# EAGLE board paris_wheel (EAGLE 7.3.0)
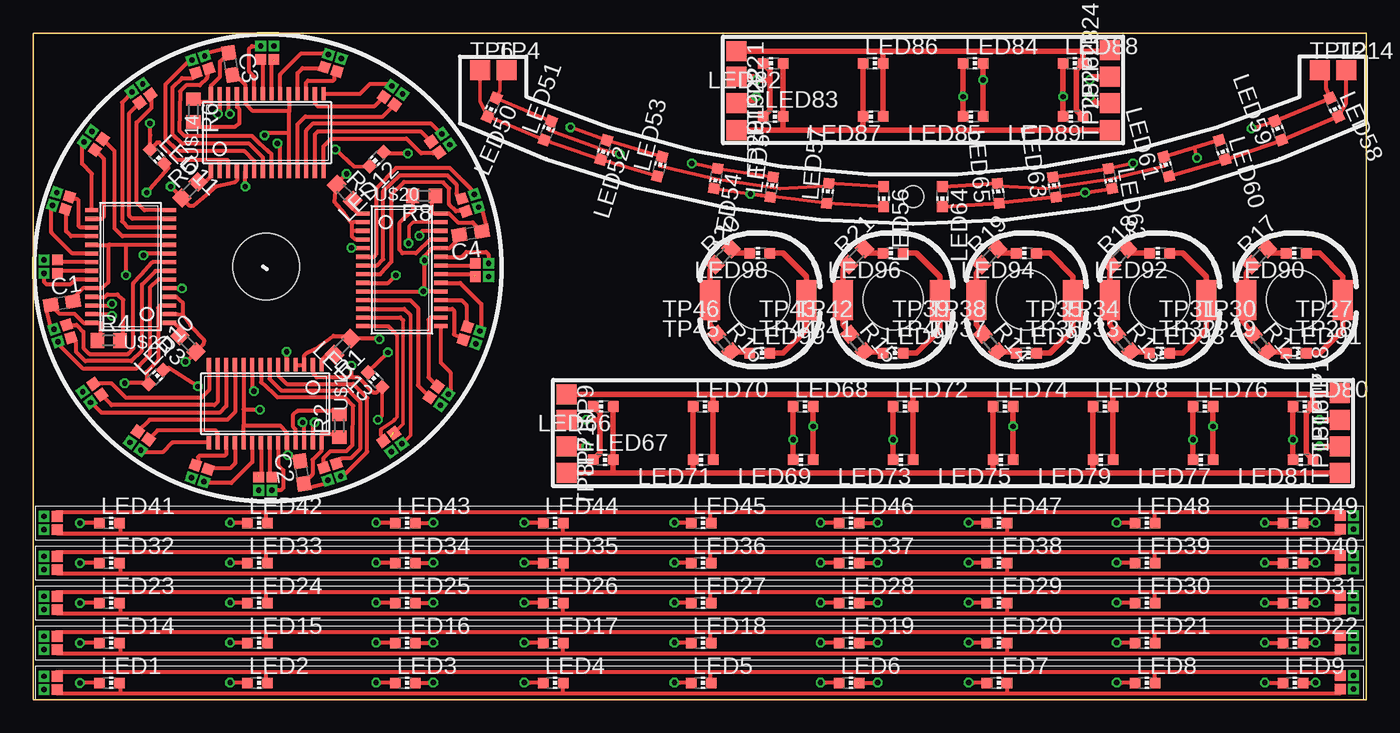
[diagram p1: board, top side]
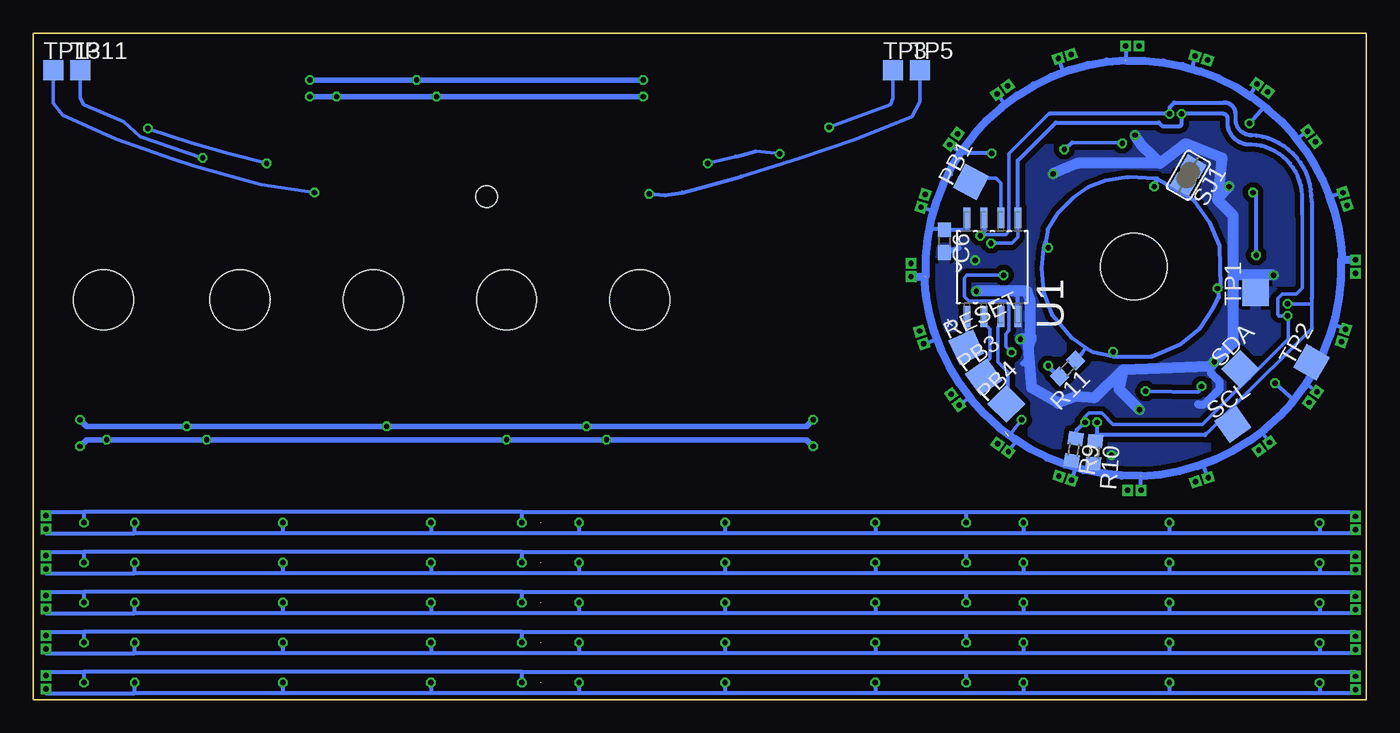
[diagram p2: board, bottom side, seen from below]

Size 100 x 50 mm. Coordinates in mm from the lower left corner, seen from the top.
Outline: 100,0 100,50 0,50 0,0 100,0
Copper layers (1*16): Top 0.035mm / dielectric 1.5mm / Bottom 0.035mm
Design rules "Elecrow_2-layer_eagle_rule *": minimum track width 6mil, minimum drill 12mil, track to track 6mil, track to pad 6mil, pad to pad 6mil, via to via 6mil, smd to smd 0mil, copper to edge 10mil, drill to drill 10mil, minimum pad ring 6mil, minimum via ring 6mil, stop-mask expansion 2mil, vias tented up to drill 100mil, thermal gap 10mil
Holes 5 mm at 17.45,32.5
Holes 1.6 mm at 66,37.75
Holes 4.5 mm at 94.75,30 84.5,30 74.5,30 64.5,30 54.5,30
bRestrict: area 11.6,26.2 to 23.7,38.4

## Footprints (pad centres in the part's own frame; a part is rotated, then mirrored left to right if it is on the bottom)
C0603 = smd 1.1 x 1: 1 -0.85,0; 2 0.85,0
CHIP-LED0603 = smd 0.8 x 0.8: A 0,-0.75; C 0,0.75
TP20SQ = smd 2 x 2: TP 0,0
R0603 = smd 1 x 1.1: 1 -0.85,0; 2 0.85,0
SJ = smd 1.168 x 1.6: 1 -0.762,0; 2 0.762,0
TP15SQ = smd 1.5 x 1.5: TP 0,0
SOIC127P798X216-8N = smd 1.549 x 0.533: 1 -3.708,1.905; 2 -3.708,0.635; 3 -3.708,-0.635; 4 -3.708,-1.905; 5 3.708,-1.905; 6 3.708,-0.635; 7 3.708,0.635; 8 3.708,1.905
TSSOP28 = smd 0.305 x 0.991: 1 -4.225,-2.918; 2 -3.575,-2.918; 3 -2.925,-2.918; 4 -2.275,-2.918; 5 -1.625,-2.918; 6 -0.975,-2.918; 7 -0.325,-2.918; 8 0.325,-2.918; 9 0.975,-2.918; 10 1.625,-2.918; 11 2.275,-2.918; 12 2.925,-2.918; 13 3.575,-2.918; 14 4.225,-2.918; 15 4.225,2.918; 16 3.575,2.918; 17 2.925,2.918; 18 2.275,2.918; 19 1.625,2.918; 20 0.975,2.918; 21 0.325,2.918; 22 -0.325,2.918; 23 -0.975,2.918; 24 -1.625,2.918; 25 -2.275,2.918; 26 -2.925,2.918; 27 -3.575,2.918; 28 -4.225,2.918
MINI-PCB-CONNECTOR = drill 0.4 pad 0.8 square: A 0,0; B 0,-1 | smd 0.8 x 0.8: C 1,-1; V+ 1,0

## Placement (x,y rotation side)
C1  100n  [C0603]  2.15,29.75 9 top
C2  100n  [C0603]  20.15,17.05 99 top
C3  100n  [C0603]  14.8,47.7 279 top
C4  100n  [C0603]  32.8,35 189 top
C6  NO MOUNT  [C0603]  31.65,34.4 270 bottom
LED1  RED  [CHIP-LED0603]  5.7,1.25 270 top
LED2  BLUE  [CHIP-LED0603]  16.8,1.25 270 top
LED3  YELLOW  [CHIP-LED0603]  27.9,1.25 270 top
LED4  RED  [CHIP-LED0603]  39,1.25 270 top
LED5  BLUE  [CHIP-LED0603]  50.1,1.25 270 top
LED6  YELLOW  [CHIP-LED0603]  61.2,1.25 270 top
LED7  RED  [CHIP-LED0603]  72.3,1.25 270 top
LED8  BLUE  [CHIP-LED0603]  83.4,1.25 270 top
LED9  YELLOW  [CHIP-LED0603]  94.5,1.25 270 top
LED10  BLUE  [CHIP-LED0603]  9.2,24.2 315 top
LED11  BLUE  [CHIP-LED0603]  9.3,40.75 225 top
LED12  BLUE  [CHIP-LED0603]  25.75,40.55 135 top
LED13  BLUE  [CHIP-LED0603]  25.65,24 45 top
LED14  RED  [CHIP-LED0603]  5.7,4.25 270 top
LED15  BLUE  [CHIP-LED0603]  16.8,4.25 270 top
LED16  YELLOW  [CHIP-LED0603]  27.9,4.25 270 top
LED17  RED  [CHIP-LED0603]  39,4.25 270 top
LED18  BLUE  [CHIP-LED0603]  50.1,4.25 270 top
LED19  YELLOW  [CHIP-LED0603]  61.2,4.25 270 top
LED20  RED  [CHIP-LED0603]  72.3,4.25 270 top
LED21  BLUE  [CHIP-LED0603]  83.4,4.25 270 top
LED22  YELLOW  [CHIP-LED0603]  94.5,4.25 270 top
LED23  RED  [CHIP-LED0603]  5.7,7.25 270 top
LED24  BLUE  [CHIP-LED0603]  16.8,7.25 270 top
LED25  YELLOW  [CHIP-LED0603]  27.9,7.25 270 top
LED26  RED  [CHIP-LED0603]  39,7.25 270 top
LED27  BLUE  [CHIP-LED0603]  50.1,7.25 270 top
LED28  YELLOW  [CHIP-LED0603]  61.2,7.25 270 top
LED29  RED  [CHIP-LED0603]  72.3,7.25 270 top
LED30  BLUE  [CHIP-LED0603]  83.4,7.25 270 top
LED31  YELLOW  [CHIP-LED0603]  94.5,7.25 270 top
LED32  RED  [CHIP-LED0603]  5.7,10.25 270 top
LED33  BLUE  [CHIP-LED0603]  16.8,10.25 270 top
LED34  YELLOW  [CHIP-LED0603]  27.9,10.25 270 top
LED35  RED  [CHIP-LED0603]  39,10.25 270 top
LED36  BLUE  [CHIP-LED0603]  50.1,10.25 270 top
LED37  YELLOW  [CHIP-LED0603]  61.2,10.25 270 top
LED38  RED  [CHIP-LED0603]  72.3,10.25 270 top
LED39  BLUE  [CHIP-LED0603]  83.4,10.25 270 top
LED40  YELLOW  [CHIP-LED0603]  94.5,10.25 270 top
LED41  RED  [CHIP-LED0603]  5.7,13.25 270 top
LED42  BLUE  [CHIP-LED0603]  16.8,13.25 270 top
LED43  YELLOW  [CHIP-LED0603]  27.9,13.25 270 top
LED44  RED  [CHIP-LED0603]  39,13.25 270 top
LED45  BLUE  [CHIP-LED0603]  50.1,13.25 270 top
LED46  YELLOW  [CHIP-LED0603]  61.2,13.25 270 top
LED47  RED  [CHIP-LED0603]  72.3,13.25 270 top
LED48  BLUE  [CHIP-LED0603]  83.4,13.25 270 top
LED49  YELLOW  [CHIP-LED0603]  94.5,13.25 270 top
LED50  NO MOUNT (RED)  [CHIP-LED0603]  34.4,44.45 156 top
LED51  NO MOUNT (BLUE)  [CHIP-LED0603]  38.6,42.7 340 top
LED52  NO MOUNT (YELLOW)  [CHIP-LED0603]  42.8,41.25 163 top
LED53  NO MOUNT (RED)  [CHIP-LED0603]  47,40 346 top
LED54  NO MOUNT (BLUE)  [CHIP-LED0603]  51.2,39.1 170 top
LED55  NO MOUNT (RED)  [CHIP-LED0603]  55.4,38.45 352 top
LED56  NO MOUNT (BLUE)  [CHIP-LED0603]  63.8,37.75 180 top
LED57  NO MOUNT (YELLOW)  [CHIP-LED0603]  59.6,38 355 top
LED58  NO MOUNT (RED)  [CHIP-LED0603]  97.6,44.45 204 top
LED59  NO MOUNT (BLUE)  [CHIP-LED0603]  93.4,42.7 20 top
LED60  NO MOUNT (YELLOW)  [CHIP-LED0603]  89.2,41.25 197 top
LED61  NO MOUNT (RED)  [CHIP-LED0603]  85,40 15 top
LED62  NO MOUNT (BLUE)  [CHIP-LED0603]  80.8,39.1 190 top
LED63  NO MOUNT (RED)  [CHIP-LED0603]  76.6,38.45 8 top
LED64  NO MOUNT (BLUE)  [CHIP-LED0603]  68.2,37.75 180 top
LED65  NO MOUNT (YELLOW)  [CHIP-LED0603]  72.4,38 5 top
LED66  YELLOW  [CHIP-LED0603]  42.75,22 90 top
LED67  RED  [CHIP-LED0603]  42.75,18 270 top
LED68  BLUE  [CHIP-LED0603]  57.75,22 270 top
LED69  YELLOW  [CHIP-LED0603]  57.75,18 90 top
LED70  RED  [CHIP-LED0603]  50.25,22 270 top
LED71  BLUE  [CHIP-LED0603]  50.25,18 90 top
LED72  YELLOW  [CHIP-LED0603]  65.25,22 270 top
LED73  RED  [CHIP-LED0603]  65.25,18 90 top
LED74  RED  [CHIP-LED0603]  72.75,22 270 top
LED75  BLUE  [CHIP-LED0603]  72.75,18 90 top
LED76  YELLOW  [CHIP-LED0603]  87.75,22 270 top
LED77  RED  [CHIP-LED0603]  87.75,18 90 top
LED78  BLUE  [CHIP-LED0603]  80.25,22 270 top
LED79  YELLOW  [CHIP-LED0603]  80.25,18 90 top
LED80  RED  [CHIP-LED0603]  95.25,22 270 top
LED81  BLUE  [CHIP-LED0603]  95.25,18 90 top
LED82  BLUE  [CHIP-LED0603]  55.5,47.75 90 top
LED83  YELLOW  [CHIP-LED0603]  55.5,43.75 270 top
LED84  RED  [CHIP-LED0603]  70.5,47.75 270 top
LED85  BLUE  [CHIP-LED0603]  70.5,43.75 90 top
LED86  YELLOW  [CHIP-LED0603]  63,47.75 270 top
LED87  RED  [CHIP-LED0603]  63,43.75 90 top
LED88  BLUE  [CHIP-LED0603]  78,47.75 270 top
LED89  YELLOW  [CHIP-LED0603]  78,43.75 90 top
LED90  YELLOW  [CHIP-LED0603]  94.75,33.5 90 top
LED91  BLUE  [CHIP-LED0603]  94.75,26 270 top
LED92  YELLOW  [CHIP-LED0603]  84.5,33.5 90 top
LED93  BLUE  [CHIP-LED0603]  84.5,26 270 top
LED94  YELLOW  [CHIP-LED0603]  74.5,33.5 90 top
LED95  BLUE  [CHIP-LED0603]  74.5,26 270 top
LED96  YELLOW  [CHIP-LED0603]  64.5,33.5 90 top
LED97  BLUE  [CHIP-LED0603]  64.5,26 270 top
LED98  YELLOW  [CHIP-LED0603]  54.5,33.5 90 top
LED99  BLUE  [CHIP-LED0603]  54.5,26 270 top
PB1  TESTPAD  [TP20SQ]  29.65,38.85 62 bottom
PB3  TESTPAD  [TP20SQ]  28.7,24.2 35 bottom
PB4  TESTPAD  [TP20SQ]  27,22.2 45 bottom
R1  NO MOUNT  [R0603]  23.2,26.5 225 top
R2  10k  [R0603]  22.95,20.55 90 top
R3  NO MOUNT  [R0603]  11.6,26.7 135 top
R4  10k  [R0603]  5.65,26.95 0 top
R5  NO MOUNT  [R0603]  11.75,38.25 45 top
R6  10K  [R0603]  12,44.2 270 top
R7  NO MOUNT  [R0603]  23.35,38.05 315 top
R8  10K  [R0603]  29.3,37.8 180 top
R9  NO MOUNT  [R0603]  21.95,18.75 260 bottom
R10  NO MOUNT  [R0603]  20.4,18.55 265 bottom
R11  NO MOUNT  [R0603]  22.4,24.85 225 bottom
R12  220R  [R0603]  92.05,26.75 310 top
R13  220R  [R0603]  81.8,26.75 310 top
R14  220R  [R0603]  71.8,26.75 310 top
R15  220R  [R0603]  61.8,26.75 310 top
R16  220R  [R0603]  51.8,26.75 310 top
R17  330R  [R0603]  92,33.25 45 top
R18  330R  [R0603]  81.5,33.25 45 top
R19  330R  [R0603]  71.75,33.25 45 top
R20  330R  [R0603]  51.75,33.25 45 top
R21  330R  [R0603]  61.75,33.25 45 top
RESET  TESTPAD  [TP20SQ]  30,26.45 25 bottom
SCL  TESTPAD  [TP20SQ]  10,20.65 35 bottom
SDA  TESTPAD  [TP20SQ]  9.45,24.8 45 bottom
SJ1  NO MOUNT  [SJ]  13.35,39.35 240 bottom
TP1  TESTPAD  [TP20SQ]  8.3,30.55 90 bottom
TP2  TESTPAD  [TP20SQ]  4.1,25.3 60 bottom
TP3  TESTPAD  [TP15SQ]  35.5,47.25 0 bottom
TP4  TESTPAD  [TP15SQ]  35.5,47.25 0 top
TP5  TESTPAD  [TP15SQ]  33.5,47.25 0 bottom
TP6  TESTPAD  [TP15SQ]  33.5,47.25 0 top
TP7  TESTPAD  [TP15SQ]  40,19 270 top
TP8  TESTPAD  [TP15SQ]  40,17 270 top
TP9  TESTPAD  [TP15SQ]  40,22.9 270 top
TP10  TESTPAD  [TP15SQ]  40,21 270 top
TP11  TESTPAD  [TP15SQ]  96.5,47.25 0 bottom
TP12  TESTPAD  [TP15SQ]  96.5,47.25 0 top
TP13  TESTPAD  [TP15SQ]  98.5,47.25 0 bottom
TP14  TESTPAD  [TP15SQ]  98.5,47.25 0 top
TP15  TESTPAD  [TP15SQ]  98,17 90 top
TP16  TESTPAD  [TP15SQ]  98,19 90 top
TP17  TESTPAD  [TP15SQ]  98,21 90 top
TP18  TESTPAD  [TP15SQ]  98,23 90 top
TP19  TESTPAD  [TP15SQ]  52.75,44.75 270 top
TP20  TESTPAD  [TP15SQ]  52.75,42.75 270 top
TP21  TESTPAD  [TP15SQ]  52.75,48.65 270 top
TP22  TESTPAD  [TP15SQ]  52.75,46.75 270 top
TP23  TESTPAD  [TP15SQ]  80.75,46.75 90 top
TP24  TESTPAD  [TP15SQ]  80.75,48.75 90 top
TP25  TESTPAD  [TP15SQ]  80.75,42.75 90 top
TP26  TESTPAD  [TP15SQ]  80.75,44.75 90 top
TP27  TESTPAD  [TP15SQ]  98.25,30.75 180 top
TP28  TESTPAD  [TP15SQ]  98.25,29.25 180 top
TP29  TESTPAD  [TP15SQ]  91,29.25 180 top
TP30  TESTPAD  [TP15SQ]  91,30.75 180 top
TP31  TESTPAD  [TP15SQ]  88,30.75 180 top
TP32  TESTPAD  [TP15SQ]  88,29.25 180 top
TP33  TESTPAD  [TP15SQ]  80.75,29.25 180 top
TP34  TESTPAD  [TP15SQ]  80.75,30.75 180 top
TP35  TESTPAD  [TP15SQ]  78,30.75 180 top
TP36  TESTPAD  [TP15SQ]  78,29.25 180 top
TP37  TESTPAD  [TP15SQ]  70.75,29.25 180 top
TP38  TESTPAD  [TP15SQ]  70.75,30.75 180 top
TP39  TESTPAD  [TP15SQ]  68,30.75 180 top
TP40  TESTPAD  [TP15SQ]  68,29.25 180 top
TP41  TESTPAD  [TP15SQ]  60.75,29.25 180 top
TP42  TESTPAD  [TP15SQ]  60.75,30.75 180 top
TP43  TESTPAD  [TP15SQ]  58,30.75 180 top
TP44  TESTPAD  [TP15SQ]  58,29.25 180 top
TP45  TESTPAD  [TP15SQ]  50.75,29.25 180 top
TP46  TESTPAD  [TP15SQ]  50.75,30.75 180 top
U1  NO MOUNT  [SOIC127P798X216-8N]  28.05,32.45 90 bottom
U$1  TLC59116IPWR  [TSSOP28]  17.4,22.2 180 top
U$2  TLC59116IPWR  [TSSOP28]  7.3,32.5 90 top
U$3  NO MOUNT  [MINI-PCB-CONNECTOR]  1.55,27.8 18 top
U$4  NO MOUNT  [MINI-PCB-CONNECTOR]  4.4,42.65 324 top
U$5  NO MOUNT  [MINI-PCB-CONNECTOR]  99.06,0.79 180 top
U$6  NO MOUNT  [MINI-PCB-CONNECTOR]  22.1,16.45 108 top
U$7  NO MOUNT  [MINI-PCB-CONNECTOR]  7.25,19.3 54 top
U$8  NO MOUNT  [MINI-PCB-CONNECTOR]  3.7,23.1 36 top
U$9  NO MOUNT  [MINI-PCB-CONNECTOR]  11.85,16.65 72 top
U$10  NO MOUNT  [MINI-PCB-CONNECTOR]  16.9,15.7 90 top
U$11  NO MOUNT  [MINI-PCB-CONNECTOR]  8.2,46.2 306 top
U$12  NO MOUNT  [MINI-PCB-CONNECTOR]  1.75,38.05 342 top
U$13  NO MOUNT  [MINI-PCB-CONNECTOR]  0.8,33 0 top
U$14  TLC59116IPWR  [TSSOP28]  17.55,42.55 0 top
U$15  NO MOUNT  [MINI-PCB-CONNECTOR]  12.85,48.3 288 top
U$16  NO MOUNT  [MINI-PCB-CONNECTOR]  27.7,45.45 234 top
U$17  NO MOUNT  [MINI-PCB-CONNECTOR]  31.25,41.65 216 top
U$18  NO MOUNT  [MINI-PCB-CONNECTOR]  23.1,48.1 252 top
U$19  NO MOUNT  [MINI-PCB-CONNECTOR]  18.05,49.05 270 top
U$20  TLC59116IPWR  [TSSOP28]  27.65,32.25 270 top
U$21  NO MOUNT  [MINI-PCB-CONNECTOR]  33.4,36.95 198 top
U$22  NO MOUNT  [MINI-PCB-CONNECTOR]  30.55,22.1 144 top
U$23  NO MOUNT  [MINI-PCB-CONNECTOR]  26.85,18.6 126 top
U$24  NO MOUNT  [MINI-PCB-CONNECTOR]  33.2,26.7 162 top
U$25  NO MOUNT  [MINI-PCB-CONNECTOR]  34.15,31.75 180 top
U$26  NO MOUNT  [MINI-PCB-CONNECTOR]  0.79,1.75 0 top
U$27  NO MOUNT  [MINI-PCB-CONNECTOR]  0.79,4.75 0 top
U$28  NO MOUNT  [MINI-PCB-CONNECTOR]  99.06,3.79 180 top
U$29  NO MOUNT  [MINI-PCB-CONNECTOR]  0.79,7.75 0 top
U$30  NO MOUNT  [MINI-PCB-CONNECTOR]  99.06,6.79 180 top
U$31  NO MOUNT  [MINI-PCB-CONNECTOR]  0.79,10.75 0 top
U$32  NO MOUNT  [MINI-PCB-CONNECTOR]  99.06,9.79 180 top
U$33  NO MOUNT  [MINI-PCB-CONNECTOR]  0.79,13.75 0 top
U$34  NO MOUNT  [MINI-PCB-CONNECTOR]  99.06,12.79 180 top

## Tracks (layer width: path | path; a pad name or v marks a point on that pad's centre or on a via)
+5V  (via drill 0.4)  (4 unrouted)
  Top 0.254: LED13.A 26.18,21.27 v25.85,21
  Top 0.305: C2.1 20.95,16.88 20.95,18 21.62,18.68 U$1.28 21.62,19.93 22.73,19.93 R2.1 22.9,19.9 | C2.1 20.28,16.12 20.4,16 | C2.1 20.7,15.9 21.9,16.2 U$6.A | C1.1 1.98,28.95 3.1,28.95 3.77,28.27 U$2.28 5.03,28.27 5.03,27.18 R4.1 5,27 | C1.1 1.22,29.62 1.1,29.5 | C1.1 1,29.2 1.3,28 U$3.A | v6.85,23.75 8.5,23.75 8.58,23.67 LED10.A 8.5,23.84 8.5,24.6 9.35,25.45 9.35,29.4 9.53,29.57 U$2.3 | v8.75,43.25 8.77,42.33 LED11.A 9.29,41.8 9.45,41.8 10.75,40.5 14.1,40.5 | C3.1 14,47.87 14,46.75 13.32,46.08 U$14.28 13.32,44.83 12.22,44.83 R6.1 12.05,44.85 | C3.1 14.67,48.63 14.55,48.75 | C3.1 14.25,48.85 13.05,48.55 U$15.A | C4.1 32.97,35.8 31.85,35.8 31.18,36.48 U$20.28 29.93,36.48 29.93,37.58 R8.1 29.95,37.75 | C4.1 33.73,35.13 33.85,35.25 | C4.1 33.95,35.55 33.65,36.75 U$21.A | LED12.A 26.37,41.08 26.45,41 v28.1,41 | U$1.2 20.98,24.48 21.25,24.2 23.85,24.2 | LED13.A 25.76,23.05 25.5,23.05 24.35,24.2 23.85,24.2 | U$14.3 14.62,40.42 14.55,40.5 14.1,40.5 | U$14.2 13.97,40.38 14.1,40.5 | v23.85,25.05 23.85,24.2
  Bottom 0.254: v25.85,21 25.93,20.9 26.82,19.75
  Bottom 0.305: v6.85,23.75 5.45,22.5 | 5.45,22.5 4.55,23.7 4.45,23.63 | U$8.A 4.45,23.63 | v8.75,43.25 7.62,44.52 | 7.62,44.52 7.15,44.15 5.27,42.13 | U$11.A 8.75,45.3 | 8.75,45.3 7.62,44.52 | U$4.A 5.2,42.05 5.27,42.13 | v28.1,41 30.35,41 | 30.35,41 30.4,41.05 U$17.A | 27.68,20.73 27.8,20.6 26.82,19.75 29.75,22.7 | U$23.A 26.2,19.45 | 26.2,19.45 27.07,20.07 | U$22.A 29.75,22.7 | U$21.A 32.5,36.7 32.5,36.65 | 32.5,36.65 31.92,38.24 31.7,38.85 31.31,39.59 | 31.31,39.59 30.85,40.45 30.54,40.79 | 30.54,40.79 30.35,41 | U$16.A 27.1,44.65 | 27.1,44.65 29.35,42.5 30.54,40.79 | U$18.A 22.75,47.1 24.65,46.3 26.6,44.95 27.1,44.65 | U$19.A 18.05,48 | U$15.A 13.1,47.4 | 13.1,47.4 15.05,47.75 18.05,47.95 | 8.75,45.3 10.15,46.2 11.95,47 13.1,47.4 | U$12.A 2.75,37.7 3.65,39.95 4.55,41.2 5.27,42.13 | U$3.A 2.45,28.1 | 2.45,28.1 2,30.2 1.9,32 1.8,32.95 | 5.45,22.5 3.63,25.44 3.4,25.85 2.45,28.1 | U$7.A 7.8,20.05 | 7.8,20.05 6.3,21.5 5.1,22.9 4.8,23.15 4.45,23.63 | U$9.A 12.25,17.7 11.1,18.15 9.2,19.05 7.8,20.05 | U$10.A 16.9,16.75 18.35,16.8 20.95,17.3 21.16,17.32 | U$6.A 21.8,17.4 | 21.8,17.4 21.16,17.32 | 26.2,19.45 24.55,18.35 23.5,17.96 | 23.5,17.96 22.8,17.7 21.8,17.4 | U$24.A 32.15,27.1 31.45,25.15 29.75,22.7 | 33.05,31.75 33,34.1 32.8,35.1 | 32.8,35.1 32.5,36.65 | 29.95,35.6 U1.8 29.95,35.25 C6.1 31.65,35.45 31.5,35.6 31.5,35.4 31.6,35.3 32.8,35.3 32.8,35.1 | 31.13,39.41 31.31,39.59 | R10.2 21.04,17.45 21.16,17.32 | R9.2 22.19,17.52 23.5,17.96 | R11.2 23.85,25 23.2,24.3 v23.85,25.05
  Bottom 0.406: TP2.TP 3.63,25.25 3.63,25.44
  Bottom 0.61: U$13.A 1.9,33 arc90 16.9,16.75 | 18.05,47.95 arc58 4.55,41.2 arc32 1.8,32.95 | U$25.A 33.05,31.75 arc90 18.05,48 | 16.9,16.8 arc90 33.15,31.8
ADR  (via drill 0.4)
  Top 0.305: v15.9,38.5 15.9,39.61 arc-90 U$14.5 | U$20.5 23.88,33.88 arc-90 v23.85,33.9 | U$1.5 arc-90 19,25.14 v19,26.1 | U$2.5 11.12,30.88 v11.15,30.85
  Bottom 0.305: 14.06,38.13 12.9,37.45 11.75,35.8 11,34.05 10.9,30.95 11,30.85 v11.15,30.85 11.05,30.85 11.05,30.2 11.5,29.35 12.5,27.85 13.9,26.7 16.1,25.75 19,25.75 v19,26.1 | 14.06,38.13 15.7,39.1 15.8,38.7 | 15.85,38.45 v15.9,38.5 15.95,38.55 15.8,38.7 | 15.8,38.7 15.8,39.1 17.9,39.2 19.55,38.95 20.85,38.45 22,37.65 23.15,36.5 23.9,35.3 24.05,34.4 | 24.05,34.4 24,34.05 v23.85,33.9 | 19,25.8 19.2,25.8 20.45,26.05 21.02,26.38 | 21.02,26.38 22.05,27.1 23.55,28.85 24.2,30.6 24.35,32.4 24.2,33.9 24.05,34.4 | SJ1.2 13.83,38.36 14.06,38.13 | R11.1 21.3,26 21.02,26.38
GND  (via drill 0.4)  (1 unrouted)
  Top 0.305: 15.75,20.6 15.78,20.52 | U$1.19 15.78,20.52 | 15.78,20.52 15.8,20.55 18.55,20.55 19.02,20.02 U$1.24 19.02,18.62 19.12,18.52 | U$1.10 15.78,21.8 | 15.78,21.8 15.78,20.52 | 19.12,18.52 19.76,17.89 C2.2 | 5.7,34.15 5.62,34.12 | U$2.19 5.62,34.12 | 5.62,34.12 5.65,34.1 5.65,31.35 5.12,30.88 U$2.24 3.73,30.88 2.99,30.14 C1.2 | U$2.10 6.95,34.12 | 6.95,34.12 5.62,34.12 | 19.2,44.15 19.18,44.23 | U$14.19 19.18,44.23 | 19.18,44.23 19.15,44.2 16.4,44.2 15.93,44.73 U$14.24 15.93,46.12 15.19,46.86 C3.2 | U$14.10 19.18,42.55 | 19.18,42.55 19.18,44.23 | 29.25,30.6 29.32,30.62 | U$20.19 29.32,30.62 | 29.32,30.62 29.3,30.65 29.3,33.25 29.93,33.88 U$20.24 31.23,33.88 31.96,34.61 C4.2 | U$20.10 29.32,30.62 | v29.25,30.65 29.45,30.65 29.4,30.8 | v17.35,42.35 17.43,42.55 19.18,42.55 | v6.95,31.85 6.95,34.12 | v17,21.75 15.82,21.75 15.78,21.8 | v23.5,39.45 22.75,38.7 R7.1 22.7,38.6 22.6,37.35 23.35,36.45 23.85,35.8 23.9,35.8 | v10.3,38.5 R5.1 11.75,37.05 12,37.05 13.7,38.5 15.1,38.8 15.28,38.98 U$14.4 | v11.4,25.35 11.45,25.35 R3.1 12.75,26.65 12.8,27 11.8,28.05 11.2,28.9 | v25.95,27.05 26.1,27.1 R1.1 23.6,27.3 22.5,27.3 21.15,26.3 20.5,26 20.32,25.82 U$1.3 U$1.4 | v19.1,18.35 19.1,18.5 19.12,18.52 | U$2.2 10.82,28.93 11.2,28.9 | 11.2,28.9 11.2,29.8 10.72,30.23 U$2.4 | U$20.4 24.18,34.52 23.9,34.75 23.9,35.15 | 23.9,35.15 23.9,35.8 | U$20.2 24.02,35.83 23.9,35.8 | U$20.3 23.93,35.17 23.9,35.15
  Bottom 0.305: U1.4 26.14,30.2 26.6,30.65 v29.25,30.65
  Bottom 0.406: C6.2 U$20.24 | 25.75,25.2 25.35,25.6 24.95,27.25 25.15,27.05
  Bottom 0.61: 12.6,22.15 12.15,22.15 11,23.3 11,23.85 11.65,24.5
  Bottom 0.813: v29.25,30.65 25.45,30.65 25.2,30 25.2,27.15 25.15,27.05 v25.95,27.05 25.4,27 25.1,23.4 23.1,22.25 21.8,22.75 20.4,22.65 18.25,24.75 | 18.25,24.75 18.55,23.3 v17,21.75 | 18.25,24.75 11.75,25 v11.4,25.35 10,26.75 10,32.05 | 10,32.05 10,36.35 11.15,37.5 | v6.95,31.85 9.8,31.85 10,32.05 | 11.15,37.5 10.8,40.65 13.55,41.7 15.45,40.25 | 15.45,40.25 16.8,41.55 v17.35,42.35 | 15.45,40.25 21.65,40.25 v23.5,39.45 | 11.15,37.5 R5.1 v10.3,38.5
  other vias: 29.35,32.95
  pour Bottom (isolate 0.406): 17.5,17.8 17.35,17.8 arc-90 2.95,32.2 2.95,32.55 arc-90 17.4,47 17.55,47 arc-90 32,32.55 32,32.3 arc-90
N$1
  Top 0.305: R2.2 22.8,21.5 22.65,21.65 19.8,21.65 19.5,21.4 19.5,20.45 19.68,20.27 U$1.25
N$2  (via drill 0.4)
  Top 0.305: LED1.A v3.49,1.25 | v92.39,1.27 93.75,1.27 LED9.A | LED2.A 14.76,1.25 v14.76,1.27 | LED5.A 48.1,1.25 v48.1,1.27 | LED8.A 81.28,1.25 v81.28,1.27 | LED4.A 36.83,1.25 v36.83,1.27 | LED3.A 25.72,1.25 v25.72,1.27 | LED6.A 59.05,1.25 v59.05,1.27 | LED7.A 70.17,1.25 v70.17,1.27
  Bottom 0.305: U$26.B 0.79,0.48 3.49,0.48 | 3.49,0.48 14.76,0.48 | 14.76,0.48 25.72,0.48 | 25.72,0.48 36.83,0.48 | 36.83,0.48 48.1,0.48 | 48.1,0.48 59.05,0.48 | 59.05,0.48 70.17,0.48 | 70.17,0.48 81.28,0.48 | 81.28,0.48 92.39,0.48 | v14.76,1.27 14.76,0.48 | v48.1,1.27 48.1,0.48 | v81.28,1.27 81.28,0.48 | v36.83,1.27 36.83,0.48 | v25.72,1.27 25.72,0.48 | v3.49,1.25 3.49,0.48 | v59.05,1.27 59.05,0.48 | v70.17,1.27 70.17,0.48 | U$5.A 99.06,0.48 92.39,0.48 | 92.39,0.48 v92.39,1.27
N$3
  Top 0.305: U$2.1 10.57,28.27 11,27.85 R3.2
N$4
  Top 0.305: U$26.C 1.75,0.75 1.75,0.48 6.51,0.48 | 6.51,0.48 39.69,0.48 | 39.69,0.48 73.03,0.48 | 73.03,0.48 98.06,0.48 U$5.V+ | LED7.C 73.03,1.25 73.03,0.48 | LED4.C 39.69,1.25 39.69,0.48 | LED1.C 6.51,1.25 6.51,0.48
N$5
  Top 0.305: U$26.V+ 1.75,1.75 1.75,2.06 17.46,2.06 | 17.46,2.06 50.8,2.06 | 50.8,2.06 84.14,2.06 | 84.14,2.06 98.06,2.06 U$5.C | LED8.C 84.14,1.25 84.14,2.06 | LED5.C 50.8,1.25 50.8,2.06 | LED2.C 17.46,1.25 17.46,2.06
N$6  (via drill 0.4)  (1 unrouted)
  Top 0.305: LED3.C 30,1.25 v30,1.27 | 61.91,1.25 v63.34,1.27 | LED9.C 96.2,1.25 v96.2,1.27
  Bottom 0.305: v30,1.27 30,2.06 | 30,2.06 0.79,2.06 U$26.A | v63.34,1.27 63.34,2.06 | 63.34,2.06 30,2.06 | 63.34,2.06 96.2,2.06 | U$5.B 99.06,2.06 96.2,2.06 | 96.2,2.06 v96.2,1.27
N$7
  Top 0.305: U$6.B 23.21,16.76 25.05,18.6 25.05,22.65 24,23.7 19,23.7 18.38,24.32 U$1.6
N$8
  Top 0.305: U$1.1 21.62,25.48 22.05,25.9 R1.2
N$9
  Top 0.305: U$2.7 9.18,32.17 8.15,31.15 8.15,26.2 7.35,25.4 3.9,25.4 3.2,26.1 3.2,26.77 U$3.C
N$10
  Top 0.305: U$1.7 17.73,24.07 18.6,23.2 23.65,23.2 24.5,22.35 24.5,18.8 23.8,18.1 23.13,18.1 U$6.C
N$11
  Top 0.305: U$6.V+ 21.79,18.14 22.3,18.65 23.5,18.65 23.95,19.1 24,22.05 23.35,22.7 18.3,22.7 18,23 17.07,23.82 U$1.8
N$12
  Top 0.305: U$8.B 4.36,22.29 5.1,21.55 14,21.55 14.47,22.02 U$1.12
N$13
  Top 0.305: U$1.13 13.82,22.32 13.6,22.1 5.88,22.1 U$8.C
N$14
  Top 0.305: U$1.15 10.43,19.28 9.7,18.55 8.22,18.55 U$7.B
N$15
  Top 0.305: U$1.16 13.82,20.02 13.65,20.2 9.33,20.2 U$7.C
N$16
  Top 0.305: U$8.V+ 4.84,23.69 4.85,23.7 4.9,23.7 4.95,23.75 5.85,23.75 6.95,22.65 12.6,22.65 13.18,23.23 U$1.14
N$17
  Top 0.305: U$1.11 15.12,21.57 14.55,21 8.73,21 U$7.V+
N$18
  Top 0.305: U$1.17 14.47,18.43 14.35,18.3 12.45,18.3 12.35,18.2 12.35,17.79 U$9.V+
N$19
  Top 0.305: U$1.18 15.12,17.73 14.75,17.35 13.17,17.35 U$9.C
N$20
  Top 0.305: U$1.20 16.43,17.82 14.85,16.25 12.89,16.25 U$9.B
N$21
  Top 0.305: U$1.21 17.07,16.88 U$10.V+
N$22
  Top 0.305: U$1.22 17.73,16.88 U$10.C
N$23
  Top 0.305: U$1.23 18.38,17.57 18.75,17.2 18.75,15.9 18.55,15.7 U$10.B
N$24  (via drill 0.4)
  Top 0.305: 16.65,23.23 16.57,23.23 v16.55,23.15 16.43,23.23 U$1.9 | v12.35,23.5 10.19,24.9 LED10.C
  Bottom 0.305: v16.55,23.15 12.6,23.1 v12.35,23.5
N$25
  Top 0.305: U$2.17 3.52,35.42 3.4,35.55 3.4,37.45 3.3,37.55 2.89,37.55 U$12.V+
N$26
  Top 0.305: U$2.18 2.83,34.77 2.45,35.15 2.45,36.73 U$12.C
N$27
  Top 0.305: U$2.20 2.92,33.48 1.35,35.05 1.35,37.01 U$12.B
N$28
  Top 0.305: U$2.21 1.98,32.83 U$13.V+
N$29
  Top 0.305: U$2.22 1.98,32.17 U$13.C
N$30
  Top 0.305: U$2.23 3.12,31.52 2.75,31.15 1,31.15 0.8,31.35 U$13.B
N$31
  Top 0.305: U$2.13 7.42,36.08 7.2,36.3 7.2,44.02 U$11.C
N$32
  Top 0.305: U$2.11 6.67,34.77 6.1,35.35 6.1,41.17 U$4.V+
N$33  (via drill 0.4)
  Top 0.305: 8.32,33.25 8.32,33.33 v8.25,33.35 8.32,33.48 U$2.9 | v8.5,38.05 10.15,39.91 LED11.C
  Bottom 0.305: v8.25,33.35 8.25,37.8 v8.5,38.05
N$34
  Top 0.305: U$3.B 1.86,26.69 3.7,24.85 7.75,24.85 8.75,25.95 8.75,30.95 9.38,31.52 U$2.6
N$35
  Top 0.305: U$3.V+ 3.24,28.11 3.75,27.6 3.75,26.4 4.2,25.95 7.1,25.95 7.5,26.35 7.5,31.25 8.1,31.9 8.93,32.83 U$2.8
N$36
  Top 0.305: U$2.15 4.38,39.47 3.65,40.2 3.65,41.68 U$4.B
N$37
  Top 0.305: U$2.16 5.12,36.08 5.3,36.25 5.3,40.57 U$4.C
N$38
  Top 0.305: U$11.B 7.39,45.54 6.65,44.8 6.65,35.9 7.12,35.42 U$2.12
N$39
  Top 0.305: U$11.V+ 8.79,45.06 8.8,45.05 8.8,45 8.85,44.95 8.85,44.4 7.75,43.3 7.75,37.3 8.32,36.73 U$2.14
N$40
  Top 0.305: R4.2 6.55,27.1 arc90 6.75,27.3 6.75,30 6.3,30.4 5.55,30.4 5.38,30.23 U$2.25
N$41
  Top 0.305: U$14.1 13.32,39.27 12.9,38.85 R5.2
N$42
  Top 0.305: U$14.7 17.23,40.67 16.2,41.7 11.15,41.7 10.45,42.4 10.45,45.95 11.15,46.65 11.98,46.65 U$15.C
N$43
  Top 0.305: U$14.17 20.48,46.33 20.6,46.45 22.5,46.45 22.6,46.55 22.6,46.96 U$18.V+
N$44
  Top 0.305: U$14.18 19.82,47.02 20.2,47.4 21.78,47.4 U$18.C
N$45
  Top 0.305: U$14.20 18.52,46.92 20.1,48.5 22.06,48.5 U$18.B
N$46
  Top 0.305: U$14.21 17.88,47.88 U$19.V+
N$47
  Top 0.305: U$14.22 17.23,47.88 U$19.C
N$48
  Top 0.305: U$14.23 16.57,46.73 16.2,47.1 16.2,48.85 16.4,49.05 U$19.B
N$49
  Top 0.305: U$14.13 21.12,42.42 21.35,42.65 29.07,42.65 U$17.C
N$50
  Top 0.305: U$14.11 19.82,43.17 20.4,43.75 26.22,43.75 U$16.V+
N$51  (via drill 0.4)
  Top 0.305: 18.3,41.52 18.38,41.67 v18.3,41.75 18.52,41.67 U$14.9 | v22.65,41.3 24.06,40 LED12.C
  Bottom 0.305: v18.3,41.75 22.05,41.8 v22.65,41.3
N$52
  Top 0.305: U$15.B 11.74,47.99 9.9,46.15 9.9,42.1 10.85,41.15 15.85,41.15 16.57,40.42 U$14.6
N$53
  Top 0.305: U$15.V+ 13,46.61 12.49,46.1 11.45,46.1 11,45.65 10.95,42.7 11.35,42.3 16.4,42.3 16.95,41.75 17.88,40.92 U$14.8
N$54
  Top 0.305: U$14.15 24.52,45.47 25.25,46.2 26.73,46.2 U$16.B
N$55
  Top 0.305: U$14.16 21.12,44.73 21.3,44.55 25.62,44.55 U$16.C
N$56
  Top 0.305: U$17.B 30.59,42.46 29.85,43.2 20.95,43.2 20.48,42.73 U$14.12
N$57
  Top 0.305: U$17.V+ 30.11,41.06 30.1,41.05 30.05,41.05 30,41 29.1,41 28,42.1 22.35,42.1 21.77,41.52 U$14.14
N$58
  Top 0.305: R6.2 12.35,43 15.15,43 15.45,43.25 15.45,44.3 15.28,44.48 U$14.25
N$59
  Top 0.305: U$20.1 24.38,36.48 23.95,36.9 R7.2
N$60
  Top 0.305: U$20.7 25.77,32.58 26.25,33.05 26.25,38.15 27.5,39.35 31.05,39.35 31.75,38.65 31.75,37.98 U$21.C
N$61
  Top 0.305: U$20.17 31.43,29.32 31.55,29.2 31.55,27.4 32.06,27.2 U$24.V+
N$62
  Top 0.305: U$20.18 32.12,29.98 32.5,29.6 32.5,28.02 U$24.C
N$63
  Top 0.305: U$20.20 32.02,31.27 33.6,29.7 33.6,27.74 U$24.B
N$64
  Top 0.305: U$20.21 32.98,31.93 U$25.V+
N$65
  Top 0.305: U$20.22 32.98,32.58 U$25.C
N$66
  Top 0.305: U$20.23 32.12,33.23 32.5,33.6 33.95,33.6 34.15,33.4 U$25.B
N$67
  Top 0.254: 27.75,28.45 27.75,20.68 U$23.C
  Top 0.305: U$20.13 27.52,28.68 27.75,28.45
N$68
  Top 0.305: U$20.11 28.27,29.98 28.85,29.4 28.85,23.58 U$22.V+
N$69  (via drill 0.4)
  Top 0.305: v26.6,26.05 25.05,24.54 LED13.C | U$20.9 26.62,31.27 v27.2,31.85
  Bottom 0.254: 26.55,26 27.05,26.5 27.05,27.45 26.8,27.7 26.8,29.65 27.05,29.9 29.8,29.9 30.15,30.25 30.15,31.65 29.95,31.85 v27.2,31.85
  Bottom 0.305: 26.55,26 v26.6,26.05
N$70
  Top 0.305: U$21.B 33.09,38.06 31.25,39.9 27.2,39.9 25.7,38.35 25.7,33.4 25.52,33.23 U$20.6
N$71
  Top 0.305: U$21.V+ 31.71,36.64 31.2,37.15 31.2,38.35 30.75,38.8 27.8,38.85 26.85,37.9 26.85,32.85 26.02,31.93 U$20.8
N$72
  Top 0.305: U$20.15 30.57,25.28 31.3,24.55 31.3,23.07 U$22.B
N$73
  Top 0.305: U$20.16 29.82,28.68 29.65,28.5 29.65,24.18 U$22.C
N$74
  Top 0.254: 28.3,28.85 28.3,19.83 U$23.B
  Top 0.305: U$23.B 27.56,19.21 | 28.3,28.85 27.82,29.32 U$20.12
N$75
  Top 0.254: 27.2,27.45 27.3,27.35 27.3,21.2 27.1,21
  Top 0.305: U$23.V+ 26.16,19.69 26.15,19.7 26.15,19.75 26.1,19.8 26.1,20.3 27.1,21 | U$20.14 26.62,28.02 27.2,27.45
N$76
  Top 0.305: R8.2 28.45,36.75 27.45,35.75 27.45,33.8 27.7,33.5 28.7,33.5 29.77,34.52 U$20.25
N$77
  Bottom 0.254: U1.1 29.95,26.11 RESET.TP
N$78
  Bottom 0.254: U1.2 28.68,28.23 28.25,27.8 28.25,25.6 28.6,25.25 28.6,24.3 PB3.TP
N$79
  Bottom 0.254: U1.3 27.41,28.18 27.65,27.95 27.65,25.35 26.9,24.6 26.9,22.25 PB4.TP
N$80
  Bottom 0.254: U1.6 27.41,38.77 27.8,39.15 29.35,39.15 PB1.TP
N$81  (via drill 0.4)
  Top 0.305: LED14.A v3.49,4.25 | v92.39,4.27 93.75,4.27 LED22.A | LED15.A 14.76,4.25 v14.76,4.27 | LED18.A 48.1,4.25 v48.1,4.27 | LED21.A 81.28,4.25 v81.28,4.27 | LED17.A 36.83,4.25 v36.83,4.27 | LED16.A 25.72,4.25 v25.72,4.27 | LED19.A 59.05,4.25 v59.05,4.27 | LED20.A 70.17,4.25 v70.17,4.27
  Bottom 0.305: U$27.B 0.79,3.48 3.49,3.48 | 3.49,3.48 14.76,3.48 | 14.76,3.48 25.72,3.48 | 25.72,3.48 36.83,3.48 | 36.83,3.48 48.1,3.48 | 48.1,3.48 59.05,3.48 | 59.05,3.48 70.17,3.48 | 70.17,3.48 81.28,3.48 | 81.28,3.48 92.39,3.48 | v14.76,4.27 14.76,3.48 | v48.1,4.27 48.1,3.48 | v81.28,4.27 81.28,3.48 | v36.83,4.27 36.83,3.48 | v25.72,4.27 25.72,3.48 | v3.49,4.25 3.49,3.48 | v59.05,4.27 59.05,3.48 | v70.17,4.27 70.17,3.48 | U$28.A 99.06,3.48 92.39,3.48 | 92.39,3.48 v92.39,4.27
N$82
  Top 0.305: U$27.C 1.75,3.75 1.75,3.48 6.51,3.48 | 6.51,3.48 39.69,3.48 | 39.69,3.48 73.03,3.48 | 73.03,3.48 98.06,3.48 U$28.V+ | LED20.C 73.03,4.25 73.03,3.48 | LED17.C 39.69,4.25 39.69,3.48 | LED14.C 6.51,4.25 6.51,3.48
N$83
  Top 0.305: U$27.V+ 1.75,4.75 1.75,5.06 17.46,5.06 | 17.46,5.06 50.8,5.06 | 50.8,5.06 84.14,5.06 | 84.14,5.06 98.06,5.06 U$28.C | LED21.C 84.14,4.25 84.14,5.06 | LED18.C 50.8,4.25 50.8,5.06 | LED15.C 17.46,4.25 17.46,5.06
N$84  (via drill 0.4)  (1 unrouted)
  Top 0.305: LED16.C 30,4.25 v30,4.27 | 61.91,4.25 v63.34,4.27 | LED22.C 96.2,4.25 v96.2,4.27
  Bottom 0.305: v30,4.27 30,5.06 | 30,5.06 0.79,5.06 U$27.A | v63.34,4.27 63.34,5.06 | 63.34,5.06 30,5.06 | 63.34,5.06 96.2,5.06 | U$28.B 99.06,5.06 96.2,5.06 | 96.2,5.06 v96.2,4.27
N$85  (via drill 0.4)
  Top 0.305: LED23.A v3.49,7.25 | v92.39,7.27 93.75,7.27 LED31.A | LED24.A 14.76,7.25 v14.76,7.27 | LED27.A 48.1,7.25 v48.1,7.27 | LED30.A 81.28,7.25 v81.28,7.27 | LED26.A 36.83,7.25 v36.83,7.27 | LED25.A 25.72,7.25 v25.72,7.27 | LED28.A 59.05,7.25 v59.05,7.27 | LED29.A 70.17,7.25 v70.17,7.27
  Bottom 0.305: U$29.B 0.79,6.48 3.49,6.48 | 3.49,6.48 14.76,6.48 | 14.76,6.48 25.72,6.48 | 25.72,6.48 36.83,6.48 | 36.83,6.48 48.1,6.48 | 48.1,6.48 59.05,6.48 | 59.05,6.48 70.17,6.48 | 70.17,6.48 81.28,6.48 | 81.28,6.48 92.39,6.48 | v14.76,7.27 14.76,6.48 | v48.1,7.27 48.1,6.48 | v81.28,7.27 81.28,6.48 | v36.83,7.27 36.83,6.48 | v25.72,7.27 25.72,6.48 | v3.49,7.25 3.49,6.48 | v59.05,7.27 59.05,6.48 | v70.17,7.27 70.17,6.48 | U$30.A 99.06,6.48 92.39,6.48 | 92.39,6.48 v92.39,7.27
N$86
  Top 0.305: U$29.C 1.75,6.75 1.75,6.48 6.51,6.48 | 6.51,6.48 39.69,6.48 | 39.69,6.48 73.03,6.48 | 73.03,6.48 98.06,6.48 U$30.V+ | LED29.C 73.03,7.25 73.03,6.48 | LED26.C 39.69,7.25 39.69,6.48 | LED23.C 6.51,7.25 6.51,6.48
N$87
  Top 0.305: U$29.V+ 1.75,7.75 1.75,8.06 17.46,8.06 | 17.46,8.06 50.8,8.06 | 50.8,8.06 84.14,8.06 | 84.14,8.06 98.06,8.06 U$30.C | LED30.C 84.14,7.25 84.14,8.06 | LED27.C 50.8,7.25 50.8,8.06 | LED24.C 17.46,7.25 17.46,8.06
N$88  (via drill 0.4)  (1 unrouted)
  Top 0.305: LED25.C 30,7.25 v30,7.27 | 61.91,7.25 v63.34,7.27 | LED31.C 96.2,7.25 v96.2,7.27
  Bottom 0.305: v30,7.27 30,8.06 | 30,8.06 0.79,8.06 U$29.A | v63.34,7.27 63.34,8.06 | 63.34,8.06 30,8.06 | 63.34,8.06 96.2,8.06 | U$30.B 99.06,8.06 96.2,8.06 | 96.2,8.06 v96.2,7.27
N$89  (via drill 0.4)
  Top 0.305: LED32.A v3.49,10.25 | v92.39,10.27 93.75,10.27 LED40.A | LED33.A 14.76,10.25 v14.76,10.27 | LED36.A 48.1,10.25 v48.1,10.27 | LED39.A 81.28,10.25 v81.28,10.27 | LED35.A 36.83,10.25 v36.83,10.27 | LED34.A 25.72,10.25 v25.72,10.27 | LED37.A 59.05,10.25 v59.05,10.27 | LED38.A 70.17,10.25 v70.17,10.27
  Bottom 0.305: U$31.B 0.79,9.48 3.49,9.48 | 3.49,9.48 14.76,9.48 | 14.76,9.48 25.72,9.48 | 25.72,9.48 36.83,9.48 | 36.83,9.48 48.1,9.48 | 48.1,9.48 59.05,9.48 | 59.05,9.48 70.17,9.48 | 70.17,9.48 81.28,9.48 | 81.28,9.48 92.39,9.48 | v14.76,10.27 14.76,9.48 | v48.1,10.27 48.1,9.48 | v81.28,10.27 81.28,9.48 | v36.83,10.27 36.83,9.48 | v25.72,10.27 25.72,9.48 | v3.49,10.25 3.49,9.48 | v59.05,10.27 59.05,9.48 | v70.17,10.27 70.17,9.48 | U$32.A 99.06,9.48 92.39,9.48 | 92.39,9.48 v92.39,10.27
N$90
  Top 0.305: U$31.C 1.75,9.75 1.75,9.48 6.51,9.48 | 6.51,9.48 39.69,9.48 | 39.69,9.48 73.03,9.48 | 73.03,9.48 98.06,9.48 U$32.V+ | LED38.C 73.03,10.25 73.03,9.48 | LED35.C 39.69,10.25 39.69,9.48 | LED32.C 6.51,10.25 6.51,9.48
N$91
  Top 0.305: U$31.V+ 1.75,10.75 1.75,11.06 17.46,11.06 | 17.46,11.06 50.8,11.06 | 50.8,11.06 84.14,11.06 | 84.14,11.06 98.06,11.06 U$32.C | LED39.C 84.14,10.25 84.14,11.06 | LED36.C 50.8,10.25 50.8,11.06 | LED33.C 17.46,10.25 17.46,11.06
N$92  (via drill 0.4)  (1 unrouted)
  Top 0.305: LED34.C 30,10.25 v30,10.27 | 61.91,10.25 v63.34,10.27 | LED40.C 96.2,10.25 v96.2,10.27
  Bottom 0.305: v30,10.27 30,11.06 | 30,11.06 0.79,11.06 U$31.A | v63.34,10.27 63.34,11.06 | 63.34,11.06 30,11.06 | 63.34,11.06 96.2,11.06 | U$32.B 99.06,11.06 96.2,11.06 | 96.2,11.06 v96.2,10.27
N$93  (via drill 0.4)
  Top 0.305: LED41.A v3.49,13.25 | v92.39,13.27 93.75,13.27 LED49.A | LED42.A 14.76,13.25 v14.76,13.27 | LED45.A 48.1,13.25 v48.1,13.27 | LED48.A 81.28,13.25 v81.28,13.27 | LED44.A 36.83,13.25 v36.83,13.27 | LED43.A 25.72,13.25 v25.72,13.27 | LED46.A 59.05,13.25 v59.05,13.27 | LED47.A 70.17,13.25 v70.17,13.27
  Bottom 0.305: U$33.B 0.79,12.48 3.49,12.48 | 3.49,12.48 14.76,12.48 | 14.76,12.48 25.72,12.48 | 25.72,12.48 36.83,12.48 | 36.83,12.48 48.1,12.48 | 48.1,12.48 59.05,12.48 | 59.05,12.48 70.17,12.48 | 70.17,12.48 81.28,12.48 | 81.28,12.48 92.39,12.48 | v14.76,13.27 14.76,12.48 | v48.1,13.27 48.1,12.48 | v81.28,13.27 81.28,12.48 | v36.83,13.27 36.83,12.48 | v25.72,13.27 25.72,12.48 | v3.49,13.25 3.49,12.48 | v59.05,13.27 59.05,12.48 | v70.17,13.27 70.17,12.48 | U$34.A 99.06,12.48 92.39,12.48 | 92.39,12.48 v92.39,13.27
N$94
  Top 0.305: U$33.C 1.75,12.75 1.75,12.48 6.51,12.48 | 6.51,12.48 39.69,12.48 | 39.69,12.48 73.03,12.48 | 73.03,12.48 98.06,12.48 U$34.V+ | LED47.C 73.03,13.25 73.03,12.48 | LED44.C 39.69,13.25 39.69,12.48 | LED41.C 6.51,13.25 6.51,12.48
N$95
  Top 0.305: U$33.V+ 1.75,13.75 1.75,14.06 17.46,14.06 | 17.46,14.06 50.8,14.06 | 50.8,14.06 84.14,14.06 | 84.14,14.06 98.06,14.06 U$34.C | LED48.C 84.14,13.25 84.14,14.06 | LED45.C 50.8,13.25 50.8,14.06 | LED42.C 17.46,13.25 17.46,14.06
N$96  (via drill 0.4)  (1 unrouted)
  Top 0.305: LED43.C 30,13.25 v30,13.27 | 61.91,13.25 v63.34,13.27 | LED49.C 96.2,13.25 v96.2,13.27
  Bottom 0.305: v30,13.27 30,14.06 | 30,14.06 0.79,14.06 U$33.A | v63.34,13.27 63.34,14.06 | 63.34,14.06 30,14.06 | 63.34,14.06 96.2,14.06 | U$34.B 99.06,14.06 96.2,14.06 | 96.2,14.06 v96.2,13.27
N$97  (via drill 0.4)
  Top 0.254: LED51.C LED50.A 35,45.75 35,46.95 | v49.4,40.25 LED54.A LED55.C | v44,40.95 42.8,41.25 38.7,42.75
  Top 0.305: 35,46.95 TP4.TP | 38.7,42.75 LED51.C
  Bottom 0.254: v49.4,40.25 47.3,40.75 | 45.8,41.15 v44,40.95
  Bottom 0.305: 47.3,40.75 45.8,41.15
N$98  (via drill 0.4)
  Top 0.254: LED56.C LED57.A v53.8,37.95 LED55.A LED54.C
  Bottom 0.254: 46.9,39.25 42.5,40.65 38.3,42.05 34.1,43.75 33.5,44.85 TP5.TP
  Bottom 0.305: v53.8,37.95 52.6,37.85 51.3,38.05 46.9,39.25
N$99
  Top 0.254: TP6.TP 33.5,44.85 LED50.C LED51.A LED52.C LED53.A
N$100  (via drill 0.4)
  Top 0.254: LED56.A LED57.C 59.4,38.55 56,38.35 51.2,39.05 47,40.05 | LED53.C LED52.A v40.3,42.95
  Top 0.305: 47,40.05 LED53.C
  Bottom 0.254: TP3.TP 35.5,45.15 35.7,44.65 v40.3,42.95
N$101  (via drill 0.4)
  Top 0.254: LED62.A v82.5,40.25 | v91.4,42.85 LED59.C
  Top 0.305: LED59.C LED58.A 97,45.85 97,47.05 TP12.TP | LED63.C LED62.A
  Bottom 0.254: v82.5,40.25 85.3,40.95 88.1,41.75 v91.4,42.85
N$102
  Top 0.305: LED61.A LED60.C LED59.A LED58.C 98.5,44.75 TP14.TP
N$103  (via drill 0.4)
  Top 0.254: LED65.C 72.5,38.55 76,38.35 80.8,39.05 82.5,39.45 84.9,40.05 LED61.C | LED60.A 87.1,41.45 v87.3,40.65
  Top 0.305: LED60.A LED61.C | LED64.A LED65.C
  Bottom 0.254: v87.3,40.65 92,42.25 93.2,43.35 96.2,44.65 96.5,45.15 TP11.TP
N$104  (via drill 0.4)
  Top 0.254: LED62.C v78.9,38.05
  Top 0.305: LED64.C LED65.A LED63.A LED62.C
  Bottom 0.254: v78.9,38.05 82.9,38.65 85.5,39.35 87.9,40.05 89.5,40.55 93.8,42.05 97.8,43.85 98.5,44.75 TP13.TP
N$105
  Top 0.406: TP25.TP 62.25,42.75 | 62.25,42.75 56.25,42.75 | 56.25,42.75 TP20.TP | 56.25,42.75 LED83.C LED82.A | LED87.C LED86.A 62.25,42.75
N$106  (via drill 0.4)
  Top 0.406: LED83.A 55.25,44.25 55.25,46.5 | 55.25,46.5 55.25,47.25 LED82.C | TP22.TP 54,46.75 v54.25,46.5 55.25,46.5 | LED84.C v71.25,46.5 LED85.A | TP23.TP 79.5,46.75 v79.25,46.5
  Bottom 0.406: v54.25,46.5 v71.25,46.5 v79.25,46.5
N$107  (via drill 0.4)
  Top 0.406: TP19.TP 53,45 54,45 v54.25,45.25 | LED85.C v69.75,45.25 LED84.A | LED89.C v77.25,45.25 LED88.A | TP26.TP 79.75,44.75 v79.25,45.25
  Bottom 0.406: v54.25,45.25 v69.75,45.25 v77.25,45.25 v79.25,45.25
N$108
  Top 0.406: TP21.TP 63.75,48.65 | 63.75,48.65 78.75,48.65 | LED87.A LED86.C 63.75,48.65 | 78.75,48.65 LED88.C 78.25,47.25 78.25,44.25 LED89.A | 78.75,48.65 80.65,48.65 TP24.TP
N$109
  Top 0.406: TP15.TP 79.5,17 | 79.5,17 72,17 | 72,17 49.5,17 | 49.5,17 43.5,17 | 43.5,17 TP8.TP | 43.5,17 LED67.C LED66.A | LED71.C LED70.A 49.5,17 | 79.5,17 LED79.C LED78.A | 72,17 LED75.C LED74.A
N$110  (via drill 0.4)
  Top 0.406: LED67.A 42.5,18.5 42.5,21 | 42.5,21 42.5,21.5 LED66.C | TP10.TP v41.5,21 42.5,21 | v96.5,21 TP17.TP | LED68.C v58.5,20.5 LED69.A | LED76.C v88.5,20.5 LED77.A | LED74.C v73.5,20.5 LED75.A
  Bottom 0.406: v41.5,21 42,20.5 v58.5,20.5 v73.5,20.5 v88.5,20.5 96,20.5 v96.5,21
N$111  (via drill 0.4)
  Top 0.406: TP7.TP v41.5,19 | v96.5,19 TP16.TP | LED69.C v57,19.5 LED68.A | LED80.A v94.5,19.5 LED81.C | LED77.C v87,19.5 LED76.A | LED73.C v64.5,19.5 LED72.A
  Bottom 0.406: v41.5,19 42,19.5 v57,19.5 v64.5,19.5 v87,19.5 v94.5,19.5 96,19.5 v96.5,19
N$112
  Top 0.406: TP9.TP 51,22.9 | 51,22.9 66,22.9 | 66,22.9 81,22.9 | 81,22.9 96,22.9 | 96,22.9 97.9,22.9 TP18.TP | LED71.A LED70.C 51,22.9 | LED73.A LED72.C 66,22.9 | 81,22.9 LED78.C LED79.A | 96,22.9 LED80.C 95.5,21.5 95.5,18.5 LED81.A
N$113
  Top 0.406: R12.1 90.75,28.41 TP29.TP 90.75,30.25 TP30.TP 91,32 R17.1
N$114
  Top 0.406: LED91.C 96.5,26 98.25,27.75 TP28.TP TP27.TP 98.25,31.75 96.5,33.5 LED90.A
N$115
  Top 0.406: R12.2 93.9,26.1 LED91.A
N$116
  Top 0.406: LED93.C 86.25,26 88,27.75 TP32.TP TP31.TP 88,31.75 86.25,33.5 LED92.A
N$117
  Top 0.406: R13.1 80.75,28.16 TP33.TP TP34.TP 80.75,32 R18.1
N$118
  Top 0.406: R13.2 83.65,26.1 LED93.A
N$119
  Top 0.406: LED95.C 76.25,26 78,27.75 TP36.TP TP35.TP 78,31.75 76.25,33.5 LED94.A
N$120
  Top 0.406: R14.1 70.75,28.16 TP37.TP 70.5,30.25 TP38.TP 70.75,32 R19.1
N$121
  Top 0.406: R14.2 73.65,26.1 LED95.A
N$122
  Top 0.406: LED97.C 66.25,26 68,27.75 TP40.TP TP39.TP 68,31.75 66.25,33.5 LED96.A
N$123
  Top 0.406: R15.1 60.75,28.16 TP41.TP TP42.TP 60.75,32.25 R21.1
N$124
  Top 0.406: R15.2 63.65,26.1 LED97.A
N$125
  Top 0.406: LED99.C 56.25,26 58,27.75 TP44.TP TP43.TP 58,31.75 56.25,33.5 LED98.A
N$126
  Top 0.406: R16.1 50.75,28.16 TP45.TP 50.5,30.25 TP46.TP 50.75,32.25 R20.1
N$127
  Top 0.406: R16.2 53.65,26.1 LED99.A
N$128
  Top 0.406: R17.2 92.45,33.5 LED90.C
N$129
  Top 0.406: R18.2 82.2,33.5 LED92.C
N$130
  Top 0.406: R19.2 72.2,33.5 LED94.C
N$131
  Top 0.406: R20.2 52.7,33.5 LED98.C
N$132
  Top 0.406: R21.2 62.45,33.5 LED96.C
SCL  (via drill 0.4)
  Top 0.305: U$1.26 20.32,20.68 v20.2,20.8 | U$2.26 5.78,29.57 v5.9,29.7 | U$14.26 14.62,44.08 v14.75,43.95 | U$20.26 29.18,35.17 v28.95,34.8
  Bottom 0.254: 12,19.95 10.15,21.8 4.1,27.85 | 4.1,27.85 4.05,27.9 | 4.1,29.7 4.1,27.85 | 4.1,30.1 4.1,29.7 | 4.1,29.7 v5.9,29.7 | 23.8,43.95 26.8,40.95 26.8,35.15 27.05,34.9 28.85,34.9 v28.95,34.8
  Bottom 0.305: 23.8,43.95 v14.75,43.95 14.75,44.45 14.4,44.8 10.65,44.8 arc90 9.8,43.95 9.8,43.55 arc-90 8.6,42.35 8.65,42.35 arc90 4.1,37.4 4.1,30.1 | v28.95,34.8 28.68,35.06 U1.7 28.68,36.59 28.75,36.65 | v20.2,20.8 20.2,19.94 20.29,19.85 | 20.29,19.85 R10.1 | 12,19.95 12.1,19.85 20.29,19.85 | SCL.TP 9.6,21.25 10.15,21.8
SDA  (via drill 0.4)
  Top 0.254: U$20.27 28.48,35.83 28.2,35.55 28.2,34.3 v28.15,34.25
  Top 0.305: U$1.27 20.98,20.68 v21.1,20.8 | U$2.27 5.78,28.93 v5.9,28.8 | U$14.27 13.97,44.08 v13.85,43.95
  Bottom 0.254: 4.8,36.4 4.8,30.9 5.25,30.45 6.3,30.45 6.65,30.1 6.65,28.9 6.55,28.8 v5.9,28.8 5.85,28.75 5.85,27.05 8.78,24.12 9.3,23.6 9.35,23.6 12.3,20.65 19,20.65 19.85,21.5 20.8,21.5 21.1,21.2 v21.1,20.8 | v28.15,34.25 26.6,34.25 26.15,34.7 U1.5
  Bottom 0.305: U1.5 26.14,40.45 23.3,43.3 15.55,43.3 15.3,43.05 13.95,43.05 13.85,43.15 v13.85,43.95 10.7,43.95 arc90 10.4,43.65 10.4,43.3 arc-90 8.75,41.65 8.6,41.65 arc90 4.8,37.5 4.8,36.4 | R9.1 21.71,20.24 21.2,20.75 v21.1,20.8 | SDA.TP 8.78,24.12

## Text on the board
Document: 100n | BLUE | RED | YELLOW | BLUE | 10k | RED | YELLOW | BLUE | RED | BLUE | BLUE | 10k | 100n | YELLOW | YELLOW | YELLOW | YELLOW | YELLOW | <-- 6X YELLOW, 6X 330R | 100n | BLUE | BLUE | BLUE | BLUE | BLUE | 10k | BLUE | <-- 6X BLUE, 6X 220R | BLUE | YELLOW | RED | BLUE | YELLOW | RED | BLUE | YELLOW | RED | 10k | 100n | RED | BLUE | YELLOW | RED | BLUE | YELLOW | RED | BLUE | 6x RED------> | 6x BLUE-----> | 6x YELLOW-> | 6x RED------> | 6x BLUE-----> | 6x YELLOW-> | 6x RED------> | 6x BLUE-----> | 6x YELLOW->